# EAGLE design hbridge-2 (EAGLE 6.4)
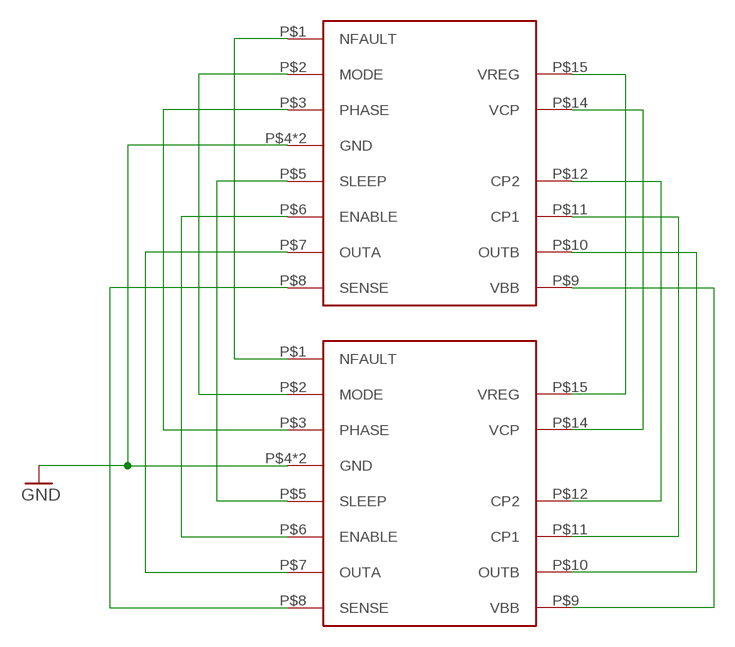
[diagram p0: schematic, sheet 1]

## Parts
U$1  A3950  [16TSSOP]
U$2  A3950-DIL  [DIL16]

## Nets
GND: U$1.P$4(GND) U$1.P$13(GND) U$2.P$4(GND) U$2.P$13(GND)
N$1: U$1.P$1(NFAULT) U$2.P$1(NFAULT)
N$5: U$1.P$2(MODE) U$2.P$2(MODE)
N$6: U$1.P$3(PHASE) U$2.P$3(PHASE)
N$8: U$1.P$6(ENABLE) U$2.P$6(ENABLE)
N$9: U$1.P$7(OUTA) U$2.P$7(OUTA)
N$10: U$1.P$8(SENSE) U$2.P$8(SENSE)
N$11: U$1.P$15(VREG) U$2.P$15(VREG)
N$12: U$1.P$14(VCP) U$2.P$14(VCP)
N$13: U$1.P$5(SLEEP) U$2.P$5(SLEEP)
N$14: U$1.P$12(CP2) U$2.P$12(CP2)
N$15: U$1.P$11(CP1) U$2.P$11(CP1)
N$16: U$1.P$10(OUTB) U$2.P$10(OUTB)
N$17: U$1.P$9(VBB) U$2.P$9(VBB)

## Library data of the parts
U$1 = A3950:A3950
U$2 = A3950:A3950-DIL

## Net classes
0 default: clearance 0.355 mm

## Board
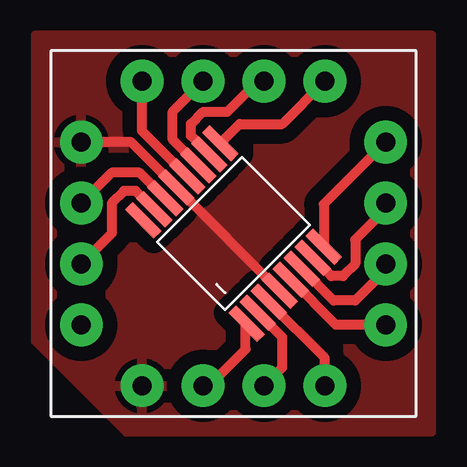
[diagram p1: board, top side]

No outline drawn. Coordinates in mm, seen from the top.
Copper layers (1*16): Top 0.035mm / dielectric 1.5mm / Bottom 0.035mm
Design rules "default": minimum track width 10mil, minimum drill 24mil, track to track 8mil, track to pad 8mil, pad to pad 8mil, via to via 8mil, smd to smd 8mil, copper to edge 40mil, drill to drill 8mil, minimum pad ring 10mil, minimum via ring 8mil, stop-mask expansion 4mil, vias tented up to drill 0mil, thermal gap 10mil

### Footprints (pad centres in the part's own frame; a part is rotated, then mirrored left to right if it is on the bottom)
16TSSOP = smd 0.45 x 1.7: P$1 -2.275,-3.05; P$2 -1.625,-3.05; P$3 -0.975,-3.05; P$4 -0.325,-3.05; P$5 0.325,-3.05; P$6 0.975,-3.05; P$7 1.625,-3.05; P$8 2.275,-3.05; P$9 2.275,3.05; P$10 1.625,3.05; P$11 0.975,3.05; P$12 0.325,3.05; P$13 -0.325,3.05; P$14 -0.975,3.05; P$15 -1.625,3.05; P$16 -2.275,3.05
DIL16 = drill 0.8 pad 1.778: P$1 -1.27,-6.35; P$2 1.27,-6.35; P$3 3.81,-6.35; P$4 -3.81,-6.35; P$5 6.35,-3.81; P$6 6.35,-1.27; P$7 6.35,1.27; P$8 6.35,3.81; P$9 3.81,6.35; P$10 1.27,6.35; P$11 -1.27,6.35; P$12 -3.81,6.35; P$13 -6.35,3.81; P$14 -6.35,1.27; P$15 -6.35,-1.27; P$16 -6.35,-3.81

### Placement (x,y rotation side)
U$1  7.62,7.62 45 top
U$2  7.62,7.62 0 top

### Tracks (layer width: path | path; a pad name or v marks a point on that pad's centre or on a via)
GND
  Top 0.406: U$2.P$13 3.35,11.43 U$1.P$13 U$1.P$4
  pour Top (isolate 0.61): -0.64,15.88 -0.64,-0.64 15.88,-0.64 15.88,15.88
N$1
  Top 0.406: U$2.P$1 6.6,1.27 8.13,2.79 8.13,3.81 U$1.P$1
N$5
  Top 0.406: U$2.P$2 9.65,2.03 9.65,3.29 U$1.P$2
N$6
  Top 0.406: U$2.P$3 11.43,2.43 U$1.P$3
N$8
  Top 0.406: U$2.P$6 13.97,6.1 12.7,4.83 11.79,4.83 U$1.P$6
N$9
  Top 0.406: U$2.P$7 13.97,8.64 12.7,7.37 12.7,6.35 12.19,5.84 11.7,5.84 U$1.P$7
N$10
  Top 0.406: U$2.P$8 11.38,8.85 U$1.P$8
N$11
  Top 0.406: U$1.P$15 3.54,9.4 3.05,9.4 2.54,8.89 2.54,7.62 U$2.P$15
N$12
  Top 0.406: U$1.P$14 3.7,10.16 2.54,10.16 U$2.P$14
N$13
  Top 0.406: U$2.P$5 11.89,3.81 U$1.P$5
N$14
  Top 0.406: U$1.P$12 3.81,11.89 U$2.P$12
N$15
  Top 0.406: U$1.P$11 5.08,11.54 5.08,12.7 U$2.P$11
N$16
  Top 0.406: U$1.P$10 5.84,11.7 5.84,12.19 6.35,12.7 7.37,12.7 8.64,13.97 U$2.P$10
N$17
  Top 0.406: U$1.P$9 7.88,12.19 9.65,12.19 U$2.P$9

### Text on the board
_tNames: C4 | IC1 | R1 | C1 | IC2 | C3 | R2 | C2 | JP1